# EAGLE schematic BMS Practice Board (EAGLE 9.2.2)
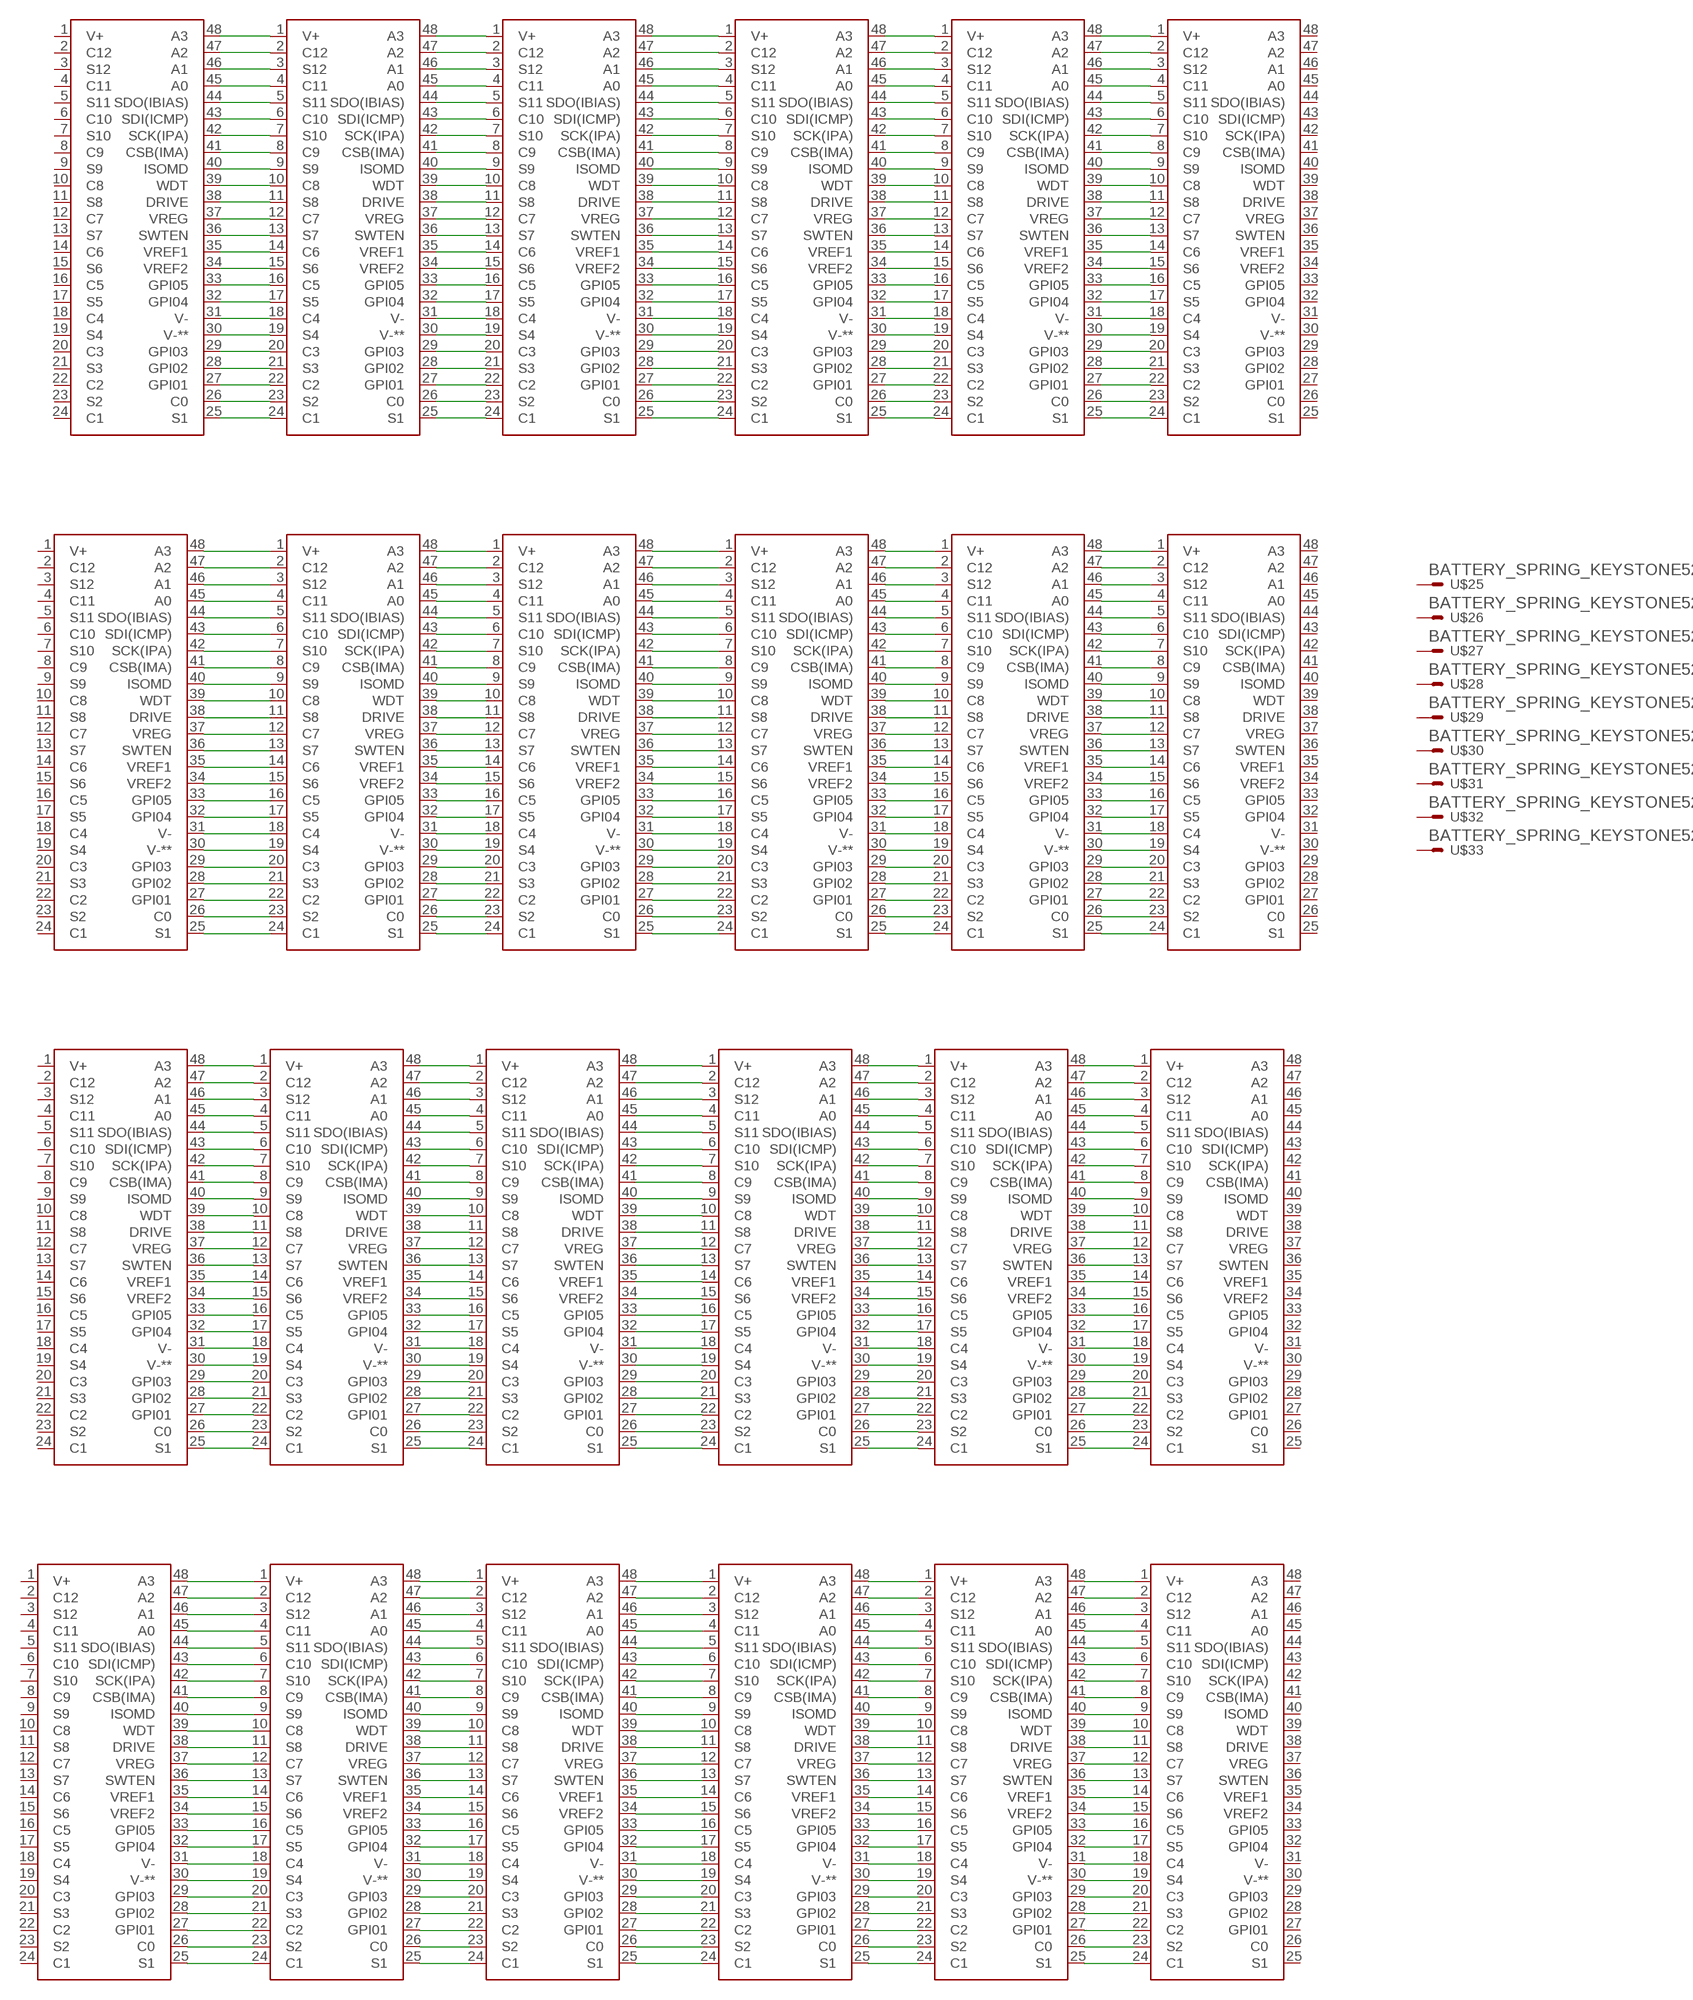
[diagram p0: schematic, sheet 1]

## Parts
U$1  LTC6804-2  [LTC6804]
U$2  LTC6804-2  [LTC6804]
U$3  LTC6804-2  [LTC6804]
U$4  LTC6804-2  [LTC6804]
U$5  LTC6804-2  [LTC6804]
U$6  LTC6804-2  [LTC6804]
U$7  LTC6804-2  [LTC6804]
U$8  LTC6804-2  [LTC6804]
U$9  LTC6804-2  [LTC6804]
U$10  LTC6804-2  [LTC6804]
U$11  LTC6804-2  [LTC6804]
U$12  LTC6804-2  [LTC6804]
U$13  LTC6804-2  [LTC6804]
U$14  LTC6804-2  [LTC6804]
U$15  LTC6804-2  [LTC6804]
U$16  LTC6804-2  [LTC6804]
U$17  LTC6804-2  [LTC6804]
U$18  LTC6804-2  [LTC6804]
U$19  LTC6804-2  [LTC6804]
U$20  LTC6804-2  [LTC6804]
U$21  LTC6804-2  [LTC6804]
U$22  LTC6804-2  [LTC6804]
U$23  LTC6804-2  [LTC6804]
U$24  LTC6804-2  [LTC6804]
U$25  BATTERY_SPRING_KEYSTONE5222  [KEYSTONE5222]
U$26  BATTERY_SPRING_KEYSTONE5222  [KEYSTONE5222]
U$27  BATTERY_SPRING_KEYSTONE5222  [KEYSTONE5222]
U$28  BATTERY_SPRING_KEYSTONE5222  [KEYSTONE5222]
U$29  BATTERY_SPRING_KEYSTONE5222  [KEYSTONE5222]
U$30  BATTERY_SPRING_KEYSTONE5222  [KEYSTONE5222]
U$31  BATTERY_SPRING_KEYSTONE5222  [KEYSTONE5222]
U$32  BATTERY_SPRING_KEYSTONE5222  [KEYSTONE5222]
U$33  BATTERY_SPRING_KEYSTONE5222  [KEYSTONE5222]

## Nets
N$1: U$1.48(A3) U$2.1(V+)
N$2: U$1.47(A2) U$2.2(C12)
N$3: U$1.46(A1) U$2.3(S12)
N$4: U$1.45(A0) U$2.4(C11)
N$5: U$1.44(SDO(IBIAS)) U$2.5(S11)
N$6: U$1.43(SDI(ICMP)) U$2.6(C10)
N$7: U$1.42(SCK(IPA)) U$2.7(S10)
N$8: U$1.41(CSB(IMA)) U$2.8(C9)
N$9: U$1.40(ISOMD) U$2.9(S9)
N$10: U$1.39(WDT) U$2.10(C8)
N$11: U$1.38(DRIVE) U$2.11(S8)
N$12: U$1.37(VREG) U$2.12(C7)
N$13: U$1.36(SWTEN) U$2.13(S7)
N$14: U$1.35(VREF1) U$2.14(C6)
N$15: U$1.34(VREF2) U$2.15(S6)
N$16: U$1.33(GPI05) U$2.16(C5)
N$17: U$1.32(GPI04) U$2.17(S5)
N$18: U$1.31(V-) U$2.18(C4)
N$19: U$1.30(V-**) U$2.19(S4)
N$20: U$1.29(GPI03) U$2.20(C3)
N$21: U$1.28(GPI02) U$2.21(S3)
N$22: U$1.27(GPI01) U$2.22(C2)
N$23: U$1.26(C0) U$2.23(S2)
N$24: U$1.25(S1) U$2.24(C1)
N$25: U$2.48(A3) U$3.1(V+)
N$26: U$2.47(A2) U$3.2(C12)
N$27: U$2.46(A1) U$3.3(S12)
N$28: U$2.45(A0) U$3.4(C11)
N$29: U$2.44(SDO(IBIAS)) U$3.5(S11)
N$30: U$2.43(SDI(ICMP)) U$3.6(C10)
N$31: U$2.42(SCK(IPA)) U$3.7(S10)
N$32: U$2.41(CSB(IMA)) U$3.8(C9)
N$33: U$2.40(ISOMD) U$3.9(S9)
N$34: U$2.39(WDT) U$3.10(C8)
N$35: U$2.38(DRIVE) U$3.11(S8)
N$36: U$2.37(VREG) U$3.12(C7)
N$37: U$2.36(SWTEN) U$3.13(S7)
N$38: U$2.35(VREF1) U$3.14(C6)
N$39: U$2.34(VREF2) U$3.15(S6)
N$40: U$2.33(GPI05) U$3.16(C5)
N$41: U$2.32(GPI04) U$3.17(S5)
N$42: U$2.31(V-) U$3.18(C4)
N$43: U$2.30(V-**) U$3.19(S4)
N$44: U$2.29(GPI03) U$3.20(C3)
N$45: U$2.28(GPI02) U$3.21(S3)
N$46: U$2.27(GPI01) U$3.22(C2)
N$47: U$2.26(C0) U$3.23(S2)
N$48: U$2.25(S1) U$3.24(C1)
N$49: U$3.48(A3) U$4.1(V+)
N$50: U$3.47(A2) U$4.2(C12)
N$51: U$3.46(A1) U$4.3(S12)
N$52: U$3.45(A0) U$4.4(C11)
N$53: U$3.44(SDO(IBIAS)) U$4.5(S11)
N$54: U$3.43(SDI(ICMP)) U$4.6(C10)
N$55: U$3.42(SCK(IPA)) U$4.7(S10)
N$56: U$3.41(CSB(IMA)) U$4.8(C9)
N$57: U$3.40(ISOMD) U$4.9(S9)
N$58: U$3.39(WDT) U$4.10(C8)
N$59: U$3.38(DRIVE) U$4.11(S8)
N$60: U$3.37(VREG) U$4.12(C7)
N$61: U$3.36(SWTEN) U$4.13(S7)
N$62: U$3.35(VREF1) U$4.14(C6)
N$63: U$3.34(VREF2) U$4.15(S6)
N$64: U$3.33(GPI05) U$4.16(C5)
N$65: U$3.32(GPI04) U$4.17(S5)
N$66: U$3.31(V-) U$4.18(C4)
N$67: U$3.30(V-**) U$4.19(S4)
N$68: U$3.29(GPI03) U$4.20(C3)
N$69: U$3.28(GPI02) U$4.21(S3)
N$70: U$3.27(GPI01) U$4.22(C2)
N$71: U$3.26(C0) U$4.23(S2)
N$72: U$3.25(S1) U$4.24(C1)
N$73: U$4.48(A3) U$5.1(V+)
N$74: U$4.47(A2) U$5.2(C12)
N$75: U$4.46(A1) U$5.3(S12)
N$76: U$4.45(A0) U$5.4(C11)
N$77: U$4.44(SDO(IBIAS)) U$5.5(S11)
N$78: U$4.43(SDI(ICMP)) U$5.6(C10)
N$79: U$4.42(SCK(IPA)) U$5.7(S10)
N$80: U$4.41(CSB(IMA)) U$5.8(C9)
N$81: U$4.40(ISOMD) U$5.9(S9)
N$82: U$4.39(WDT) U$5.10(C8)
N$83: U$4.38(DRIVE) U$5.11(S8)
N$84: U$4.37(VREG) U$5.12(C7)
N$85: U$4.36(SWTEN) U$5.13(S7)
N$86: U$4.35(VREF1) U$5.14(C6)
N$87: U$4.34(VREF2) U$5.15(S6)
N$88: U$4.33(GPI05) U$5.16(C5)
N$89: U$4.32(GPI04) U$5.17(S5)
N$90: U$4.31(V-) U$5.18(C4)
N$91: U$4.30(V-**) U$5.19(S4)
N$92: U$4.29(GPI03) U$5.20(C3)
N$93: U$4.28(GPI02) U$5.21(S3)
N$94: U$4.27(GPI01) U$5.22(C2)
N$95: U$4.26(C0) U$5.23(S2)
N$96: U$4.25(S1) U$5.24(C1)
N$97: U$5.48(A3) U$6.1(V+)
N$98: U$5.47(A2) U$6.2(C12)
N$99: U$5.46(A1) U$6.3(S12)
N$100: U$5.45(A0) U$6.4(C11)
N$101: U$5.44(SDO(IBIAS)) U$6.5(S11)
N$102: U$5.43(SDI(ICMP)) U$6.6(C10)
N$103: U$5.42(SCK(IPA)) U$6.7(S10)
N$104: U$5.41(CSB(IMA)) U$6.8(C9)
N$105: U$5.40(ISOMD) U$6.9(S9)
N$106: U$5.39(WDT) U$6.10(C8)
N$107: U$5.38(DRIVE) U$6.11(S8)
N$108: U$5.37(VREG) U$6.12(C7)
N$109: U$5.36(SWTEN) U$6.13(S7)
N$110: U$5.35(VREF1) U$6.14(C6)
N$111: U$5.34(VREF2) U$6.15(S6)
N$112: U$5.33(GPI05) U$6.16(C5)
N$113: U$5.32(GPI04) U$6.17(S5)
N$114: U$5.31(V-) U$6.18(C4)
N$115: U$5.30(V-**) U$6.19(S4)
N$116: U$5.29(GPI03) U$6.20(C3)
N$117: U$5.28(GPI02) U$6.21(S3)
N$118: U$5.27(GPI01) U$6.22(C2)
N$119: U$5.26(C0) U$6.23(S2)
N$120: U$5.25(S1) U$6.24(C1)
N$121: U$7.25(S1) U$8.24(C1)
N$122: U$7.26(C0) U$8.23(S2)
N$123: U$7.27(GPI01) U$8.22(C2)
N$124: U$7.28(GPI02) U$8.21(S3)
N$125: U$7.29(GPI03) U$8.20(C3)
N$126: U$7.30(V-**) U$8.19(S4)
N$127: U$7.31(V-) U$8.18(C4)
N$128: U$7.32(GPI04) U$8.17(S5)
N$129: U$7.33(GPI05) U$8.16(C5)
N$130: U$7.34(VREF2) U$8.15(S6)
N$131: U$7.35(VREF1) U$8.14(C6)
N$132: U$7.36(SWTEN) U$8.13(S7)
N$133: U$7.37(VREG) U$8.12(C7)
N$134: U$7.38(DRIVE) U$8.11(S8)
N$135: U$7.39(WDT) U$8.10(C8)
N$136: U$7.40(ISOMD) U$8.9(S9)
N$137: U$7.41(CSB(IMA)) U$8.8(C9)
N$138: U$7.42(SCK(IPA)) U$8.7(S10)
N$139: U$7.43(SDI(ICMP)) U$8.6(C10)
N$140: U$7.44(SDO(IBIAS)) U$8.5(S11)
N$141: U$7.45(A0) U$8.4(C11)
N$142: U$7.46(A1) U$8.3(S12)
N$143: U$7.47(A2) U$8.2(C12)
N$144: U$7.48(A3) U$8.1(V+)
N$145: U$8.25(S1) U$9.24(C1)
N$146: U$8.26(C0) U$9.23(S2)
N$147: U$8.27(GPI01) U$9.22(C2)
N$148: U$8.28(GPI02) U$9.21(S3)
N$149: U$8.29(GPI03) U$9.20(C3)
N$150: U$8.30(V-**) U$9.19(S4)
N$151: U$8.31(V-) U$9.18(C4)
N$152: U$8.32(GPI04) U$9.17(S5)
N$153: U$8.33(GPI05) U$9.16(C5)
N$154: U$8.34(VREF2) U$9.15(S6)
N$155: U$8.35(VREF1) U$9.14(C6)
N$156: U$8.36(SWTEN) U$9.13(S7)
N$157: U$8.37(VREG) U$9.12(C7)
N$158: U$8.38(DRIVE) U$9.11(S8)
N$159: U$8.39(WDT) U$9.10(C8)
N$160: U$8.40(ISOMD) U$9.9(S9)
N$161: U$8.41(CSB(IMA)) U$9.8(C9)
N$162: U$8.42(SCK(IPA)) U$9.7(S10)
N$163: U$8.43(SDI(ICMP)) U$9.6(C10)
N$164: U$8.44(SDO(IBIAS)) U$9.5(S11)
N$165: U$8.45(A0) U$9.4(C11)
N$166: U$8.46(A1) U$9.3(S12)
N$167: U$8.47(A2) U$9.2(C12)
N$168: U$8.48(A3) U$9.1(V+)
N$169: U$9.25(S1) U$10.24(C1)
N$170: U$9.26(C0) U$10.23(S2)
N$171: U$9.27(GPI01) U$10.22(C2)
N$172: U$9.28(GPI02) U$10.21(S3)
N$173: U$9.29(GPI03) U$10.20(C3)
N$174: U$9.30(V-**) U$10.19(S4)
N$175: U$9.31(V-) U$10.18(C4)
N$176: U$9.32(GPI04) U$10.17(S5)
N$177: U$9.33(GPI05) U$10.16(C5)
N$178: U$9.34(VREF2) U$10.15(S6)
N$179: U$9.35(VREF1) U$10.14(C6)
N$180: U$9.36(SWTEN) U$10.13(S7)
N$181: U$9.37(VREG) U$10.12(C7)
N$182: U$9.38(DRIVE) U$10.11(S8)
N$183: U$9.39(WDT) U$10.10(C8)
N$184: U$9.40(ISOMD) U$10.9(S9)
N$185: U$9.41(CSB(IMA)) U$10.8(C9)
N$186: U$9.42(SCK(IPA)) U$10.7(S10)
N$187: U$9.43(SDI(ICMP)) U$10.6(C10)
N$188: U$9.44(SDO(IBIAS)) U$10.5(S11)
N$189: U$9.45(A0) U$10.4(C11)
N$190: U$9.46(A1) U$10.3(S12)
N$191: U$9.47(A2) U$10.2(C12)
N$192: U$9.48(A3) U$10.1(V+)
N$193: U$10.25(S1) U$11.24(C1)
N$194: U$10.26(C0) U$11.23(S2)
N$195: U$10.27(GPI01) U$11.22(C2)
N$196: U$10.28(GPI02) U$11.21(S3)
N$197: U$10.29(GPI03) U$11.20(C3)
N$198: U$10.30(V-**) U$11.19(S4)
N$199: U$10.31(V-) U$11.18(C4)
N$200: U$10.32(GPI04) U$11.17(S5)
N$201: U$10.33(GPI05) U$11.16(C5)
N$202: U$10.34(VREF2) U$11.15(S6)
N$203: U$10.35(VREF1) U$11.14(C6)
N$204: U$10.36(SWTEN) U$11.13(S7)
N$205: U$10.37(VREG) U$11.12(C7)
N$206: U$10.38(DRIVE) U$11.11(S8)
N$207: U$10.39(WDT) U$11.10(C8)
N$208: U$10.40(ISOMD) U$11.9(S9)
N$209: U$10.41(CSB(IMA)) U$11.8(C9)
N$210: U$10.42(SCK(IPA)) U$11.7(S10)
N$211: U$10.43(SDI(ICMP)) U$11.6(C10)
N$212: U$10.44(SDO(IBIAS)) U$11.5(S11)
N$213: U$10.45(A0) U$11.4(C11)
N$214: U$10.46(A1) U$11.3(S12)
N$215: U$10.47(A2) U$11.2(C12)
N$216: U$10.48(A3) U$11.1(V+)
N$217: U$11.25(S1) U$12.24(C1)
N$218: U$11.26(C0) U$12.23(S2)
N$219: U$11.27(GPI01) U$12.22(C2)
N$220: U$11.28(GPI02) U$12.21(S3)
N$221: U$11.29(GPI03) U$12.20(C3)
N$222: U$11.30(V-**) U$12.19(S4)
N$223: U$11.31(V-) U$12.18(C4)
N$224: U$11.32(GPI04) U$12.17(S5)
N$225: U$11.33(GPI05) U$12.16(C5)
N$226: U$11.34(VREF2) U$12.15(S6)
N$227: U$11.35(VREF1) U$12.14(C6)
N$228: U$11.36(SWTEN) U$12.13(S7)
N$229: U$11.37(VREG) U$12.12(C7)
N$230: U$11.38(DRIVE) U$12.11(S8)
N$231: U$11.39(WDT) U$12.10(C8)
N$232: U$11.40(ISOMD) U$12.9(S9)
N$233: U$11.41(CSB(IMA)) U$12.8(C9)
N$234: U$11.42(SCK(IPA)) U$12.7(S10)
N$235: U$11.43(SDI(ICMP)) U$12.6(C10)
N$236: U$11.44(SDO(IBIAS)) U$12.5(S11)
N$237: U$11.45(A0) U$12.4(C11)
N$238: U$11.46(A1) U$12.3(S12)
N$239: U$11.47(A2) U$12.2(C12)
N$240: U$11.48(A3) U$12.1(V+)
N$241: U$13.48(A3) U$14.1(V+)
N$242: U$13.47(A2) U$14.2(C12)
N$243: U$13.46(A1) U$14.3(S12)
N$244: U$13.45(A0) U$14.4(C11)
N$245: U$13.44(SDO(IBIAS)) U$14.5(S11)
N$246: U$13.43(SDI(ICMP)) U$14.6(C10)
N$247: U$13.42(SCK(IPA)) U$14.7(S10)
N$248: U$13.41(CSB(IMA)) U$14.8(C9)
N$249: U$13.40(ISOMD) U$14.9(S9)
N$250: U$13.39(WDT) U$14.10(C8)
N$251: U$13.38(DRIVE) U$14.11(S8)
N$252: U$13.37(VREG) U$14.12(C7)
N$253: U$13.36(SWTEN) U$14.13(S7)
N$254: U$13.35(VREF1) U$14.14(C6)
N$255: U$13.34(VREF2) U$14.15(S6)
N$256: U$13.33(GPI05) U$14.16(C5)
N$257: U$13.32(GPI04) U$14.17(S5)
N$258: U$13.31(V-) U$14.18(C4)
N$259: U$13.30(V-**) U$14.19(S4)
N$260: U$13.29(GPI03) U$14.20(C3)
N$261: U$13.28(GPI02) U$14.21(S3)
N$262: U$13.27(GPI01) U$14.22(C2)
N$263: U$13.26(C0) U$14.23(S2)
N$264: U$13.25(S1) U$14.24(C1)
N$265: U$14.48(A3) U$15.1(V+)
N$266: U$14.47(A2) U$15.2(C12)
N$267: U$14.46(A1) U$15.3(S12)
N$268: U$14.45(A0) U$15.4(C11)
N$269: U$14.44(SDO(IBIAS)) U$15.5(S11)
N$270: U$14.43(SDI(ICMP)) U$15.6(C10)
N$271: U$14.42(SCK(IPA)) U$15.7(S10)
N$272: U$14.41(CSB(IMA)) U$15.8(C9)
N$273: U$14.40(ISOMD) U$15.9(S9)
N$274: U$14.39(WDT) U$15.10(C8)
N$275: U$14.38(DRIVE) U$15.11(S8)
N$276: U$14.37(VREG) U$15.12(C7)
N$277: U$14.36(SWTEN) U$15.13(S7)
N$278: U$14.35(VREF1) U$15.14(C6)
N$279: U$14.34(VREF2) U$15.15(S6)
N$280: U$14.33(GPI05) U$15.16(C5)
N$281: U$14.32(GPI04) U$15.17(S5)
N$282: U$14.31(V-) U$15.18(C4)
N$283: U$14.30(V-**) U$15.19(S4)
N$284: U$14.29(GPI03) U$15.20(C3)
N$285: U$14.28(GPI02) U$15.21(S3)
N$286: U$14.27(GPI01) U$15.22(C2)
N$287: U$14.26(C0) U$15.23(S2)
N$288: U$14.25(S1) U$15.24(C1)
N$289: U$15.48(A3) U$16.1(V+)
N$290: U$15.47(A2) U$16.2(C12)
N$291: U$15.46(A1) U$16.3(S12)
N$292: U$15.45(A0) U$16.4(C11)
N$293: U$15.44(SDO(IBIAS)) U$16.5(S11)
N$294: U$15.43(SDI(ICMP)) U$16.6(C10)
N$295: U$15.42(SCK(IPA)) U$16.7(S10)
N$296: U$15.41(CSB(IMA)) U$16.8(C9)
N$297: U$15.40(ISOMD) U$16.9(S9)
N$298: U$15.39(WDT) U$16.10(C8)
N$299: U$15.38(DRIVE) U$16.11(S8)
N$300: U$15.37(VREG) U$16.12(C7)
N$301: U$15.36(SWTEN) U$16.13(S7)
N$302: U$15.35(VREF1) U$16.14(C6)
N$303: U$15.34(VREF2) U$16.15(S6)
N$304: U$15.33(GPI05) U$16.16(C5)
N$305: U$15.32(GPI04) U$16.17(S5)
N$306: U$15.31(V-) U$16.18(C4)
N$307: U$15.30(V-**) U$16.19(S4)
N$308: U$15.29(GPI03) U$16.20(C3)
N$309: U$15.28(GPI02) U$16.21(S3)
N$310: U$15.27(GPI01) U$16.22(C2)
N$311: U$15.26(C0) U$16.23(S2)
N$312: U$15.25(S1) U$16.24(C1)
N$313: U$16.48(A3) U$17.1(V+)
N$314: U$16.47(A2) U$17.2(C12)
N$315: U$16.46(A1) U$17.3(S12)
N$316: U$16.45(A0) U$17.4(C11)
N$317: U$16.44(SDO(IBIAS)) U$17.5(S11)
N$318: U$16.43(SDI(ICMP)) U$17.6(C10)
N$319: U$16.42(SCK(IPA)) U$17.7(S10)
N$320: U$16.41(CSB(IMA)) U$17.8(C9)
N$321: U$16.40(ISOMD) U$17.9(S9)
N$322: U$16.39(WDT) U$17.10(C8)
N$323: U$16.38(DRIVE) U$17.11(S8)
N$324: U$16.37(VREG) U$17.12(C7)
N$325: U$16.36(SWTEN) U$17.13(S7)
N$326: U$16.35(VREF1) U$17.14(C6)
N$327: U$16.34(VREF2) U$17.15(S6)
N$328: U$16.33(GPI05) U$17.16(C5)
N$329: U$16.32(GPI04) U$17.17(S5)
N$330: U$16.31(V-) U$17.18(C4)
N$331: U$16.30(V-**) U$17.19(S4)
N$332: U$16.29(GPI03) U$17.20(C3)
N$333: U$16.28(GPI02) U$17.21(S3)
N$334: U$16.27(GPI01) U$17.22(C2)
N$335: U$16.26(C0) U$17.23(S2)
N$336: U$16.25(S1) U$17.24(C1)
N$337: U$17.48(A3) U$18.1(V+)
N$338: U$17.47(A2) U$18.2(C12)
N$339: U$17.46(A1) U$18.3(S12)
N$340: U$17.45(A0) U$18.4(C11)
N$341: U$17.44(SDO(IBIAS)) U$18.5(S11)
N$342: U$17.43(SDI(ICMP)) U$18.6(C10)
N$343: U$17.42(SCK(IPA)) U$18.7(S10)
N$344: U$17.41(CSB(IMA)) U$18.8(C9)
N$345: U$17.40(ISOMD) U$18.9(S9)
N$346: U$17.39(WDT) U$18.10(C8)
N$347: U$17.38(DRIVE) U$18.11(S8)
N$348: U$17.37(VREG) U$18.12(C7)
N$349: U$17.36(SWTEN) U$18.13(S7)
N$350: U$17.35(VREF1) U$18.14(C6)
N$351: U$17.34(VREF2) U$18.15(S6)
N$352: U$17.33(GPI05) U$18.16(C5)
N$353: U$17.32(GPI04) U$18.17(S5)
N$354: U$17.31(V-) U$18.18(C4)
N$355: U$17.30(V-**) U$18.19(S4)
N$356: U$17.29(GPI03) U$18.20(C3)
N$357: U$17.28(GPI02) U$18.21(S3)
N$358: U$17.27(GPI01) U$18.22(C2)
N$359: U$17.26(C0) U$18.23(S2)
N$360: U$17.25(S1) U$18.24(C1)
N$361: U$19.25(S1) U$20.24(C1)
N$362: U$19.26(C0) U$20.23(S2)
N$363: U$19.27(GPI01) U$20.22(C2)
N$364: U$19.28(GPI02) U$20.21(S3)
N$365: U$19.29(GPI03) U$20.20(C3)
N$366: U$19.30(V-**) U$20.19(S4)
N$367: U$19.31(V-) U$20.18(C4)
N$368: U$19.32(GPI04) U$20.17(S5)
N$369: U$19.33(GPI05) U$20.16(C5)
N$370: U$19.34(VREF2) U$20.15(S6)
N$371: U$19.35(VREF1) U$20.14(C6)
N$372: U$19.36(SWTEN) U$20.13(S7)
N$373: U$19.37(VREG) U$20.12(C7)
N$374: U$19.38(DRIVE) U$20.11(S8)
N$375: U$19.39(WDT) U$20.10(C8)
N$376: U$19.40(ISOMD) U$20.9(S9)
N$377: U$19.41(CSB(IMA)) U$20.8(C9)
N$378: U$19.42(SCK(IPA)) U$20.7(S10)
N$379: U$19.43(SDI(ICMP)) U$20.6(C10)
N$380: U$19.44(SDO(IBIAS)) U$20.5(S11)
N$381: U$19.45(A0) U$20.4(C11)
N$382: U$19.46(A1) U$20.3(S12)
N$383: U$19.47(A2) U$20.2(C12)
N$384: U$19.48(A3) U$20.1(V+)
N$385: U$20.25(S1) U$21.24(C1)
N$386: U$20.26(C0) U$21.23(S2)
N$387: U$20.27(GPI01) U$21.22(C2)
N$388: U$20.28(GPI02) U$21.21(S3)
N$389: U$20.29(GPI03) U$21.20(C3)
N$390: U$20.30(V-**) U$21.19(S4)
N$391: U$20.31(V-) U$21.18(C4)
N$392: U$20.32(GPI04) U$21.17(S5)
N$393: U$20.33(GPI05) U$21.16(C5)
N$394: U$20.34(VREF2) U$21.15(S6)
N$395: U$20.35(VREF1) U$21.14(C6)
N$396: U$20.36(SWTEN) U$21.13(S7)
N$397: U$20.37(VREG) U$21.12(C7)
N$398: U$20.38(DRIVE) U$21.11(S8)
N$399: U$20.39(WDT) U$21.10(C8)
N$400: U$20.40(ISOMD) U$21.9(S9)
N$401: U$20.41(CSB(IMA)) U$21.8(C9)
N$402: U$20.42(SCK(IPA)) U$21.7(S10)
N$403: U$20.43(SDI(ICMP)) U$21.6(C10)
N$404: U$20.44(SDO(IBIAS)) U$21.5(S11)
N$405: U$20.45(A0) U$21.4(C11)
N$406: U$20.46(A1) U$21.3(S12)
N$407: U$20.47(A2) U$21.2(C12)
N$408: U$20.48(A3) U$21.1(V+)
N$409: U$21.25(S1) U$22.24(C1)
N$410: U$21.26(C0) U$22.23(S2)
N$411: U$21.27(GPI01) U$22.22(C2)
N$412: U$21.28(GPI02) U$22.21(S3)
N$413: U$21.29(GPI03) U$22.20(C3)
N$414: U$21.30(V-**) U$22.19(S4)
N$415: U$21.31(V-) U$22.18(C4)
N$416: U$21.32(GPI04) U$22.17(S5)
N$417: U$21.33(GPI05) U$22.16(C5)
N$418: U$21.34(VREF2) U$22.15(S6)
N$419: U$21.35(VREF1) U$22.14(C6)
N$420: U$21.36(SWTEN) U$22.13(S7)
N$421: U$21.37(VREG) U$22.12(C7)
N$422: U$21.38(DRIVE) U$22.11(S8)
N$423: U$21.39(WDT) U$22.10(C8)
N$424: U$21.40(ISOMD) U$22.9(S9)
N$425: U$21.41(CSB(IMA)) U$22.8(C9)
N$426: U$21.42(SCK(IPA)) U$22.7(S10)
N$427: U$21.43(SDI(ICMP)) U$22.6(C10)
N$428: U$21.44(SDO(IBIAS)) U$22.5(S11)
N$429: U$21.45(A0) U$22.4(C11)
N$430: U$21.46(A1) U$22.3(S12)
N$431: U$21.47(A2) U$22.2(C12)
N$432: U$21.48(A3) U$22.1(V+)
N$433: U$22.25(S1) U$23.24(C1)
N$434: U$22.26(C0) U$23.23(S2)
N$435: U$22.27(GPI01) U$23.22(C2)
N$436: U$22.28(GPI02) U$23.21(S3)
N$437: U$22.29(GPI03) U$23.20(C3)
N$438: U$22.30(V-**) U$23.19(S4)
N$439: U$22.31(V-) U$23.18(C4)
N$440: U$22.32(GPI04) U$23.17(S5)
N$441: U$22.33(GPI05) U$23.16(C5)
N$442: U$22.34(VREF2) U$23.15(S6)
N$443: U$22.35(VREF1) U$23.14(C6)
N$444: U$22.36(SWTEN) U$23.13(S7)
N$445: U$22.37(VREG) U$23.12(C7)
N$446: U$22.38(DRIVE) U$23.11(S8)
N$447: U$22.39(WDT) U$23.10(C8)
N$448: U$22.40(ISOMD) U$23.9(S9)
N$449: U$22.41(CSB(IMA)) U$23.8(C9)
N$450: U$22.42(SCK(IPA)) U$23.7(S10)
N$451: U$22.43(SDI(ICMP)) U$23.6(C10)
N$452: U$22.44(SDO(IBIAS)) U$23.5(S11)
N$453: U$22.45(A0) U$23.4(C11)
N$454: U$22.46(A1) U$23.3(S12)
N$455: U$22.47(A2) U$23.2(C12)
N$456: U$22.48(A3) U$23.1(V+)
N$457: U$23.25(S1) U$24.24(C1)
N$458: U$23.26(C0) U$24.23(S2)
N$459: U$23.27(GPI01) U$24.22(C2)
N$460: U$23.28(GPI02) U$24.21(S3)
N$461: U$23.29(GPI03) U$24.20(C3)
N$462: U$23.30(V-**) U$24.19(S4)
N$463: U$23.31(V-) U$24.18(C4)
N$464: U$23.32(GPI04) U$24.17(S5)
N$465: U$23.33(GPI05) U$24.16(C5)
N$466: U$23.34(VREF2) U$24.15(S6)
N$467: U$23.35(VREF1) U$24.14(C6)
N$468: U$23.36(SWTEN) U$24.13(S7)
N$469: U$23.37(VREG) U$24.12(C7)
N$470: U$23.38(DRIVE) U$24.11(S8)
N$471: U$23.39(WDT) U$24.10(C8)
N$472: U$23.40(ISOMD) U$24.9(S9)
N$473: U$23.41(CSB(IMA)) U$24.8(C9)
N$474: U$23.42(SCK(IPA)) U$24.7(S10)
N$475: U$23.43(SDI(ICMP)) U$24.6(C10)
N$476: U$23.44(SDO(IBIAS)) U$24.5(S11)
N$477: U$23.45(A0) U$24.4(C11)
N$478: U$23.46(A1) U$24.3(S12)
N$479: U$23.47(A2) U$24.2(C12)
N$480: U$23.48(A3) U$24.1(V+)
Unconnected: U$1.1(V+) U$1.2(C12) U$1.3(S12) U$1.4(C11) U$1.5(S11) U$1.6(C10) U$1.7(S10) U$1.8(C9) U$1.9(S9) U$1.10(C8) U$1.11(S8) U$1.12(C7) U$1.13(S7) U$1.14(C6) U$1.15(S6) U$1.16(C5) U$1.17(S5) U$1.18(C4) U$1.19(S4) U$1.20(C3) U$1.21(S3) U$1.22(C2) U$1.23(S2) U$1.24(C1) U$6.25(S1) U$6.26(C0) U$6.27(GPI01) U$6.28(GPI02) U$6.29(GPI03) U$6.30(V-**) U$6.31(V-) U$6.32(GPI04) U$6.33(GPI05) U$6.34(VREF2) U$6.35(VREF1) U$6.36(SWTEN) U$6.37(VREG) U$6.38(DRIVE) U$6.39(WDT) U$6.40(ISOMD) U$6.41(CSB(IMA)) U$6.42(SCK(IPA)) U$6.43(SDI(ICMP)) U$6.44(SDO(IBIAS)) U$6.45(A0) U$6.46(A1) U$6.47(A2) U$6.48(A3) U$7.1(V+) U$7.2(C12) U$7.3(S12) U$7.4(C11) U$7.5(S11) U$7.6(C10) U$7.7(S10) U$7.8(C9) U$7.9(S9) U$7.10(C8) U$7.11(S8) U$7.12(C7) U$7.13(S7) U$7.14(C6) U$7.15(S6) U$7.16(C5) U$7.17(S5) U$7.18(C4) U$7.19(S4) U$7.20(C3) U$7.21(S3) U$7.22(C2) U$7.23(S2) U$7.24(C1) U$12.25(S1) U$12.26(C0) U$12.27(GPI01) U$12.28(GPI02) U$12.29(GPI03) U$12.30(V-**) U$12.31(V-) U$12.32(GPI04) U$12.33(GPI05) U$12.34(VREF2) U$12.35(VREF1) U$12.36(SWTEN) U$12.37(VREG) U$12.38(DRIVE) U$12.39(WDT) U$12.40(ISOMD) U$12.41(CSB(IMA)) U$12.42(SCK(IPA)) U$12.43(SDI(ICMP)) U$12.44(SDO(IBIAS)) U$12.45(A0) U$12.46(A1) U$12.47(A2) U$12.48(A3) U$13.1(V+) U$13.2(C12) U$13.3(S12) U$13.4(C11) U$13.5(S11) U$13.6(C10) U$13.7(S10) U$13.8(C9) U$13.9(S9) U$13.10(C8) U$13.11(S8) U$13.12(C7) U$13.13(S7) U$13.14(C6) U$13.15(S6) U$13.16(C5) U$13.17(S5) U$13.18(C4) U$13.19(S4) U$13.20(C3) U$13.21(S3) U$13.22(C2) U$13.23(S2) U$13.24(C1) U$18.25(S1) U$18.26(C0) U$18.27(GPI01) U$18.28(GPI02) U$18.29(GPI03) U$18.30(V-**) U$18.31(V-) U$18.32(GPI04) U$18.33(GPI05) U$18.34(VREF2) U$18.35(VREF1) U$18.36(SWTEN) U$18.37(VREG) U$18.38(DRIVE) U$18.39(WDT) U$18.40(ISOMD) U$18.41(CSB(IMA)) U$18.42(SCK(IPA)) U$18.43(SDI(ICMP)) U$18.44(SDO(IBIAS)) U$18.45(A0) U$18.46(A1) U$18.47(A2) U$18.48(A3) U$19.1(V+) U$19.2(C12) U$19.3(S12) U$19.4(C11) U$19.5(S11) U$19.6(C10) U$19.7(S10) U$19.8(C9) U$19.9(S9) U$19.10(C8) U$19.11(S8) U$19.12(C7) U$19.13(S7) U$19.14(C6) U$19.15(S6) U$19.16(C5) U$19.17(S5) U$19.18(C4) U$19.19(S4) U$19.20(C3) U$19.21(S3) U$19.22(C2) U$19.23(S2) U$19.24(C1) U$24.25(S1) U$24.26(C0) U$24.27(GPI01) U$24.28(GPI02) U$24.29(GPI03) U$24.30(V-**) U$24.31(V-) U$24.32(GPI04) U$24.33(GPI05) U$24.34(VREF2) U$24.35(VREF1) U$24.36(SWTEN) U$24.37(VREG) U$24.38(DRIVE) U$24.39(WDT) U$24.40(ISOMD) U$24.41(CSB(IMA)) U$24.42(SCK(IPA)) U$24.43(SDI(ICMP)) U$24.44(SDO(IBIAS)) U$24.45(A0) U$24.46(A1) U$24.47(A2) U$24.48(A3) U$25.P$1(S) U$26.P$1(S) U$27.P$1(S) U$28.P$1(S) U$29.P$1(S) U$30.P$1(S) U$31.P$1(S) U$32.P$1(S) U$33.P$1(S)

## Library data of the parts
U$1-U$24 = HyTechDevices:LTC6804-2: Linear Technology Multicell Battery Stack Monitor Variant 2: Addressable/Multi-Drop Configuration Datasheet <http://cds.linear.com/docs/en/datasheet/680412fc.pdf>
U$25-U$33 = HyTechDevices:BATTERY_SPRING: Keystone Electronics Battery Spring Contact Datasheet <http://keyelco.com/userAssets/file/M65p17.pdf>

## Net classes
0 default: width 0.254 mm